# EAGLE design eagle-TSL2591 (EAGLE 7.3.0)
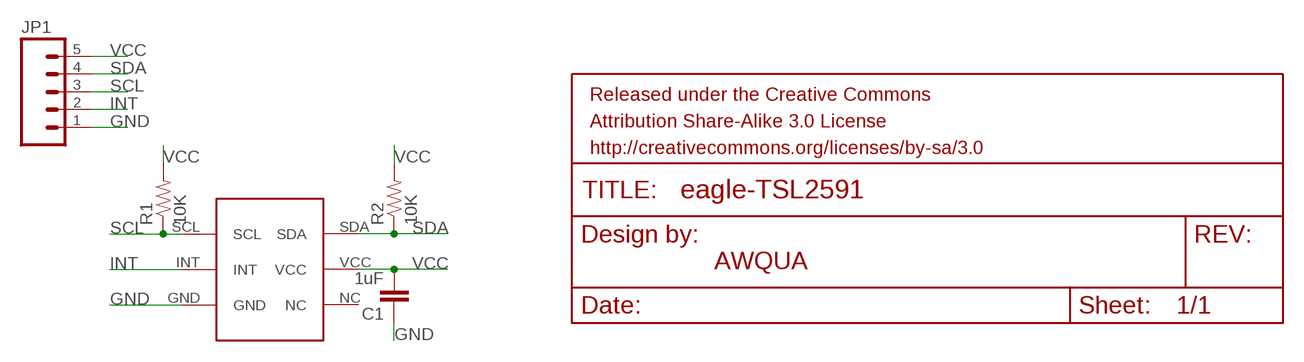
[diagram p0: schematic, sheet 1]

## Parts
C1  1uF  CAP0603-CAP  [0603-CAP]
FRAME1  FRAME-LETTER  [CREATIVE_COMMONS]
JP1  M05NO_SILK  [1X05_NO_SILK]
R1  10K  RESISTOR0603-RES  [0603-RES]
R2  10K  RESISTOR0603-RES  [0603-RES]
U$1  TSL2591  [TSL2591]

## Nets
GND: C1.1 JP1.1 U$1.GND
INT: JP1.2 U$1.INT
SCL: JP1.3 R1.1 U$1.SCL
SDA: JP1.4 R2.1 U$1.SDA
VCC: C1.2 JP1.5 R1.2 R2.2 U$1.VCC
Unconnected: U$1.NC

## Notes on the sheet
- AWQUA

## Library data of the parts
C1 = SparkFun-Passives:CAP: Capacitor Standard 0603 ceramic capacitor, and 0.1" leaded capacitor.
FRAME1 = SparkFun-Aesthetics:FRAME-LETTER: Schematic Frame Standard 8.5x11 US Letter frame
JP1 = SparkFun-Connectors:M05: Header 5 Standard 5-pin 0.1" header. Use with straight break away headers (SKU : PRT-00116), right angle break away headers (PRT-00553), swiss pins (PRT-00743), machine pins (PRT-00117), and female headers (PRT-00115). Molex polarized connector foot print use with SKU : PRT-08230 with associated crimp pins and housings.
R1 R2 = SparkFun-Passives:RESISTOR: Resistor Basic schematic elements and footprints for 0603, 1206, and PTH resistors.
U$1 = awqua_eagle_library:TSL2591

## Board
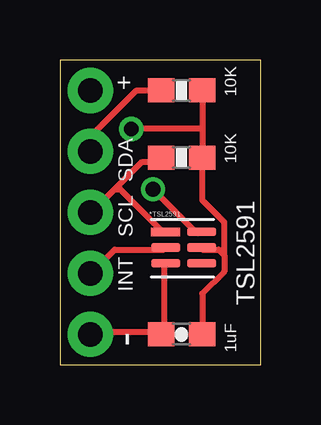
[diagram p1: board, top side]
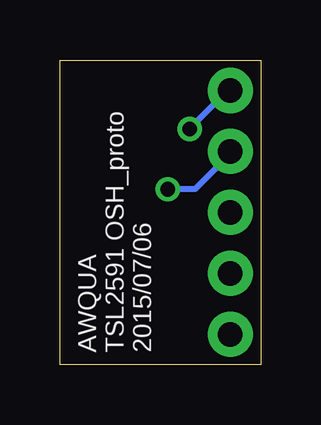
[diagram p2: board, bottom side, seen from below]

Size 8.38 x 12.7 mm. Coordinates in mm from the lower left corner, seen from the top.
Outline: 0,0 8.38,0 8.38,12.7 0,12.69 0,0
Copper layers (1*16): Top 0.035mm / dielectric 1.5mm / Bottom 0.035mm
Design rules "default": minimum track width 10mil, minimum drill 24mil, track to track 8mil, track to pad 8mil, pad to pad 8mil, via to via 8mil, smd to smd 8mil, copper to edge 40mil, drill to drill 8mil, minimum pad ring 10mil, minimum via ring 8mil, stop-mask expansion 4mil, vias tented up to drill 0mil, thermal gap 10mil

### Footprints (pad centres in the part's own frame; a part is rotated, then mirrored left to right if it is on the bottom)
0603-CAP = smd 1.1 x 1: 1 -0.85,0; 2 0.85,0
1X05_NO_SILK = drill 1.016 pad 1.88: 1 0,0; 2 2.54,0; 3 5.08,0; 4 7.62,0; 5 10.16,0
0603-RES = smd 1.1 x 1: 1 -0.85,0; 2 0.85,0
TSL2591 = smd 1.2 x 0.35: GND 0.6,0.175; INT 0.6,0.825; NC 2.1,0.175; SCL 0.6,1.475; SDA 2.1,1.475; VCC 2.1,0.825

### Placement (x,y rotation side)
C1  5.08,1.27 0 top
FRAME1  2.54,-10.41 0 top  (outside the outline)
JP1  1.27,1.27 90 top
R1  5.08,8.64 0 top
R2  5.08,11.43 0 top
U$1  3.81,4.06 0 top

### Tracks (layer width: path | path; a pad name or v marks a point on that pad's centre or on a via)
GND
  Top 0.254: U$1.GND 4.34,4.12 4.34,1.37 C1.1 4.12,1.37 1.37,1.37 JP1.1
INT
  Top 0.254: U$1.INT 4.34,4.8 2.29,4.8 1.37,3.89 JP1.2
SCL
  Top 0.254: 2.29,7.32 1.37,6.4 JP1.3 | 2.29,7.32 3.43,8.46 4.12,8.46 R1.1 | 2.29,7.32 2.52,7.32 4.34,5.49 U$1.SCL
SDA  (via drill 0.61)
  Top 0.254: R2.1 3.2,11.43 1.37,9.6 1.37,8.91 JP1.4 | v3.89,7.32 5.71,5.49 U$1.SDA
  Bottom 0.254: v3.89,7.32 2.74,7.32 1.37,8.69 JP1.4
VCC  (via drill 0.61)
  Top 0.254: 5.94,9.83 5.94,11.43 R2.2 | 5.94,9.83 5.94,8.69 R1.2 5.94,8.46 5.94,6.86 6.86,5.94 6.86,4.57 | 6.86,4.57 6.86,3.89 5.94,2.97 5.94,1.37 C1.2 | 6.86,4.57 6.63,4.8 5.94,4.8 U$1.VCC | 5.94,9.83 v2.97,9.83
  Bottom 0.254: v2.97,9.83 1.37,11.43 JP1.5

### Text on the board
tNames: + | SDA | TSL2591 | SCL | INT | - | AWQUA
bNames: AWQUA / TSL2591 OSH_proto / 2015/07/06